# Altium schematic sheet DB_Common.SchDoc: Daughter Board Top Level
size A4; SheetNumber: 1; SheetTotal: 19; PageSetup: Record=PageOptions|CenterHorizontal=True|CenterVertical=True|PrintScale=0.71|XCorrection=1.00|YCorrection=1.00|PrintKind=0|BorderSize=5000000|LeftOffset=0|BottomOffset=0|Orientation=2|PaperLength=1000|PaperWidth=1000|Scale=100|PaperSource=262|PrintQuality=600|MediaType=1|DitherType=10|PaperKind=A4|PrintScaleMode=1
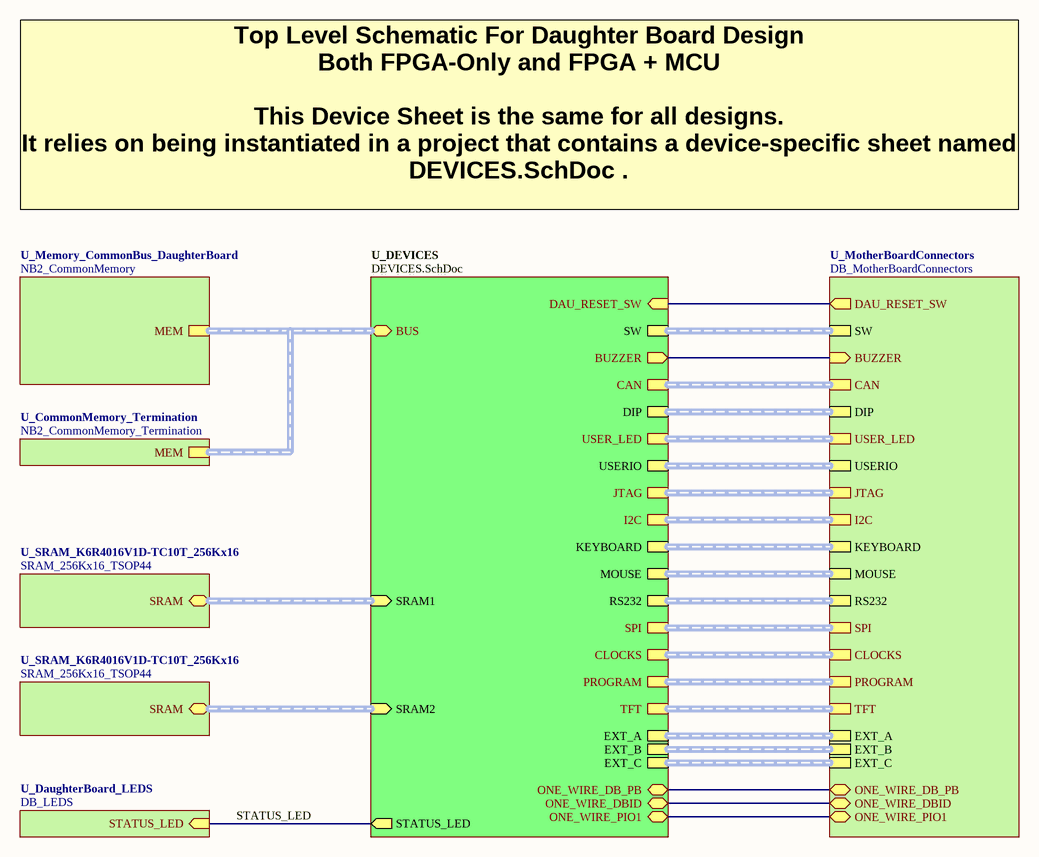
[diagram p0: DB_Common.SchDoc]

## Sub-sheets
U_CommonMemory_Termination = NB2_CommonMemory_Termination: MEM (harness HOSTMEMORY)
U_DaughterBoard_LEDS = DB_LEDS: STATUS_LED (in)
U_DEVICES = DEVICES.SchDoc: SRAM1, STATUS_LED (out), SRAM2, BUS (harness HOSTMEMORY), DAU_RESET_SW (in), BUZZER (out), ONE_WIRE_DBID (bidir), ONE_WIRE_DB_PB (bidir), ONE_WIRE_PIO1 (bidir), JTAG (harness HardSoft_JTAG), SW (harness SW5), DIP (harness SW8), USERIO (harness IO36), EXT_A (harness PBIO), EXT_B (harness PBIO), EXT_C (harness PBIO), USER_LED (harness LED8), SPI (harness DAU_SPI), I2C (harness I2C), CAN (harness CAN_INT), RS232 (harness RS232_INT), KEYBOARD (harness PS2), MOUSE (harness PS2), TFT (harness DAU_TFT), PROGRAM (harness DAU_CTRL), CLOCKS (harness DAU_CLK)
U_Memory_CommonBus_DaughterBoard = NB2_CommonMemory: MEM (harness HOSTMEMORY)
U_MotherBoardConnectors = DB_MotherBoardConnectors: DAU_RESET_SW (out), BUZZER (in), ONE_WIRE_DBID (bidir), ONE_WIRE_DB_PB (bidir), ONE_WIRE_PIO1 (bidir), JTAG (harness HardSoft_JTAG), SW (harness SW5), DIP (harness SW8), USERIO (harness IO36), EXT_A (harness PBIO), EXT_B (harness PBIO), EXT_C (harness PBIO), USER_LED (harness LED8), SPI (harness DAU_SPI), I2C (harness I2C), CAN (harness CAN_INT), RS232 (harness RS232_INT), KEYBOARD (harness PS2), MOUSE (harness PS2), TFT (harness DAU_TFT), PROGRAM (harness DAU_CTRL), CLOCKS (harness DAU_CLK)
U_SRAM_K6R4016V1D-TC10T_256Kx16 = SRAM_256Kx16_TSOP44: SRAM (harness SRAM-256Kx16)
U_SRAM_K6R4016V1D-TC10T_256Kx16 = SRAM_256Kx16_TSOP44: SRAM (harness SRAM-256Kx16)

## Nets
STATUS_LED: sheet U_DEVICES/STATUS_LED, sheet U_DaughterBoard_LEDS/STATUS_LED
(unnamed): sheet U_DEVICES/DAU_RESET_SW, sheet U_MotherBoardConnectors/DAU_RESET_SW
(unnamed): sheet U_DEVICES/BUZZER, sheet U_MotherBoardConnectors/BUZZER
(unnamed): sheet U_DEVICES/ONE_WIRE_DBID, sheet U_MotherBoardConnectors/ONE_WIRE_DBID
(unnamed): sheet U_DEVICES/ONE_WIRE_DB_PB, sheet U_MotherBoardConnectors/ONE_WIRE_DB_PB
(unnamed): sheet U_DEVICES/ONE_WIRE_PIO1, sheet U_MotherBoardConnectors/ONE_WIRE_PIO1

## Buses and harness runs
harness sheet U_CommonMemory_Termination/MEM = sheet U_DEVICES/BUS = sheet U_Memory_CommonBus_DaughterBoard/MEM
harness sheet U_DEVICES/CAN = sheet U_MotherBoardConnectors/CAN
harness sheet U_DEVICES/CLOCKS = sheet U_MotherBoardConnectors/CLOCKS
harness sheet U_DEVICES/DIP = sheet U_MotherBoardConnectors/DIP
harness sheet U_DEVICES/EXT_A = sheet U_MotherBoardConnectors/EXT_A
harness sheet U_DEVICES/EXT_B = sheet U_MotherBoardConnectors/EXT_B
harness sheet U_DEVICES/EXT_C = sheet U_MotherBoardConnectors/EXT_C
harness sheet U_DEVICES/I2C = sheet U_MotherBoardConnectors/I2C
harness sheet U_DEVICES/JTAG = sheet U_MotherBoardConnectors/JTAG
harness sheet U_DEVICES/KEYBOARD = sheet U_MotherBoardConnectors/KEYBOARD
harness sheet U_DEVICES/MOUSE = sheet U_MotherBoardConnectors/MOUSE
harness sheet U_DEVICES/PROGRAM = sheet U_MotherBoardConnectors/PROGRAM
harness sheet U_DEVICES/RS232 = sheet U_MotherBoardConnectors/RS232
harness sheet U_DEVICES/SPI = sheet U_MotherBoardConnectors/SPI
harness sheet U_DEVICES/SRAM1 = sheet U_SRAM_K6R4016V1D-TC10T_256Kx16/SRAM
harness sheet U_DEVICES/SRAM2 = sheet U_SRAM_K6R4016V1D-TC10T_256Kx16/SRAM
harness sheet U_DEVICES/SW = sheet U_MotherBoardConnectors/SW
harness sheet U_DEVICES/TFT = sheet U_MotherBoardConnectors/TFT
harness sheet U_DEVICES/USER_LED = sheet U_MotherBoardConnectors/USER_LED
harness sheet U_DEVICES/USERIO = sheet U_MotherBoardConnectors/USERIO

## Notes on the sheet
- Top Level Schematic For Daughter Board Design
  Both FPGA-Only and FPGA + MCU
  This Device Sheet is the same for all designs.
  It relies on being instantiated in a project that contains a device-specific sheet named DEVICES.SchDoc .
- Sheet Title
- Project Title
- Size:
- Date:
- A4
- Assy:
- Time:
- Sheet
- Revision:
- of
- File: